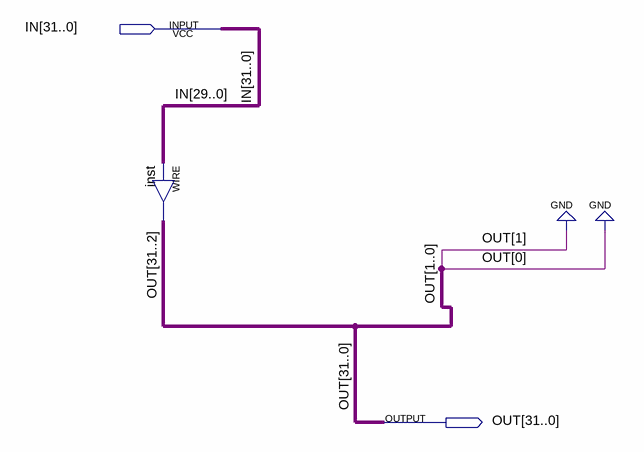
[diagram p0: schematic sheet]
// Quartus schematic Shift_left2_32bit.bdf as structural Verilog: 1 symbols, 2 pins
module Shift_left2_32bit (
  input  [31:0] IN,
  output [31:0] OUT
);

  assign OUT[31:2] = IN[29:0];  // WIRE inst

  assign OUT[1:0] = 2'b00;
endmodule
